# Altium project ActuatorMKII.PrjPcb
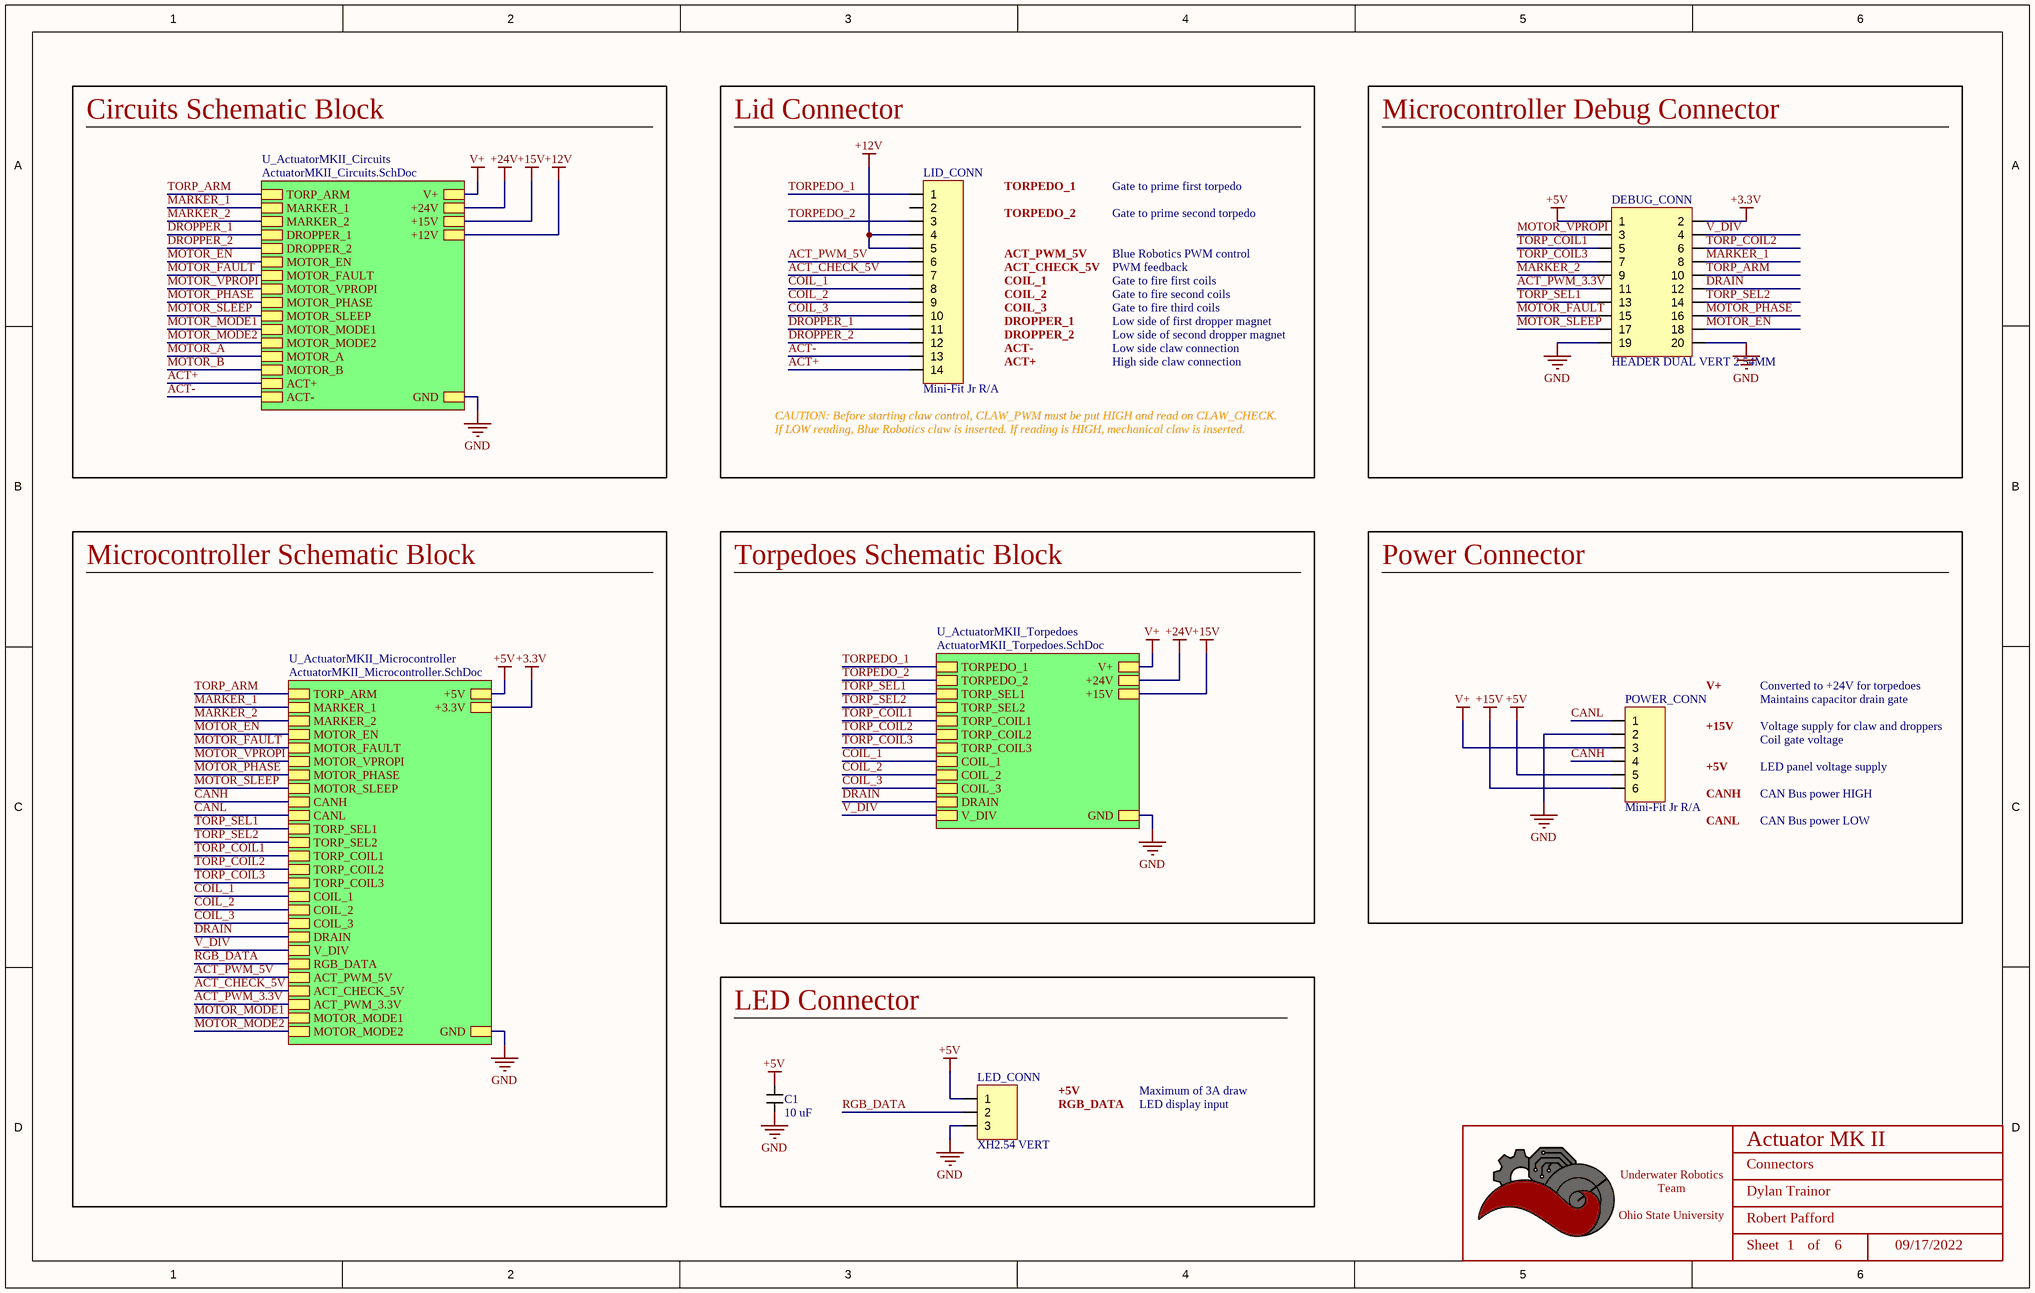
[diagram p0: ActuatorMKII_Connectors.SchDoc]
BoardRevision: 1.1; DateOfDesignReview: 01/07/2023; ProjectTitle: Actuator MK II; TeamLead: Robert Pafford
4 sheets, 100 parts. Net scope: strictly hierarchical (ports join the sheet entries above them; power ports are local).
Board file: ActuatorMKII.PcbDoc
Sheets:
  ActuatorMKII_Connectors.SchDoc
    U_ActuatorMKII_Circuits = ActuatorMKII_Circuits.SchDoc
    U_ActuatorMKII_Torpedoes = ActuatorMKII_Torpedoes.SchDoc
    U_ActuatorMKII_Microcontroller = ActuatorMKII_Microcontroller.SchDoc

## Sheet ActuatorMKII_Connectors.SchDoc: Connectors
size B; Date: 09/17/2022; Author: Dylan Trainor; Organization: ORGANIZATION; Address1: ADDRESS 1; Address2: ADDRESS 2; Address3: ADDRESS 3; Address4: ADDRESS 4; DocumentNumber: 1; Revision: -; SheetNumber: 1; SheetTotal: 6; ENG_APP_DATE: --/--/--; DSN_APP_DATE: --/--/--; CHK_APP_DATE: --/--/--

### Parts
(Parts that share a designator on the sheet are numbered #1, #2 ... from top to bottom, then left to right.)
*#1  Title_Block  [LOGO]  (value not drawn)  (graphical)
C1  Value (uF): 10 uF  [CAPACITOR_0603]  (hidden comment: 10uF Ceramic 6.3V)
DEBUG_CONN  HEADER DUAL VERT 2.54MM  [HEADER_2x10PIN_2.54MM]
LED_CONN  XH2.54 VERT  [CONN_JST_XH254_3POS_VERT]
LID_CONN  Mini-Fit Jr R/A  [CONN_MOLEX_MINIFIT JR_14 POS_R/A]
POWER_CONN  Mini-Fit Jr R/A  [CONN_MOLEX_MINIFIT JR_6 POS_R/A]

### Blocks framed on the sheet
Lid Connector: LID_CONN
Microcontroller Debug Connector: DEBUG_CONN
Power Connector: POWER_CONN
LED Connector: C1 LED_CONN

### Sub-sheets
U_ActuatorMKII_Circuits = ActuatorMKII_Circuits.SchDoc: V+, +15V, +12V, +24V, GND, TORP_ARM, MARKER_1, MARKER_2, DROPPER_1, DROPPER_2, MOTOR_EN, MOTOR_FAULT, MOTOR_VPROPI, MOTOR_PHASE, MOTOR_SLEEP, MOTOR_MODE1, MOTOR_MODE2, MOTOR_A, MOTOR_B, ACT+, ACT-
U_ActuatorMKII_Microcontroller = ActuatorMKII_Microcontroller.SchDoc: GND, +5V, +3.3V, TORP_ARM, MARKER_1, MARKER_2, MOTOR_EN, MOTOR_FAULT, MOTOR_VPROPI, MOTOR_PHASE, MOTOR_SLEEP, CANH, CANL, TORP_SEL1, TORP_SEL2, TORP_COIL1, TORP_COIL2, TORP_COIL3, COIL_1, COIL_2, COIL_3, DRAIN, V_DIV, RGB_DATA, ACT_PWM_5V, ACT_CHECK_5V, ACT_PWM_3.3V, MOTOR_MODE1, MOTOR_MODE2
U_ActuatorMKII_Torpedoes = ActuatorMKII_Torpedoes.SchDoc: V+, +15V, +24V, GND, TORPEDO_1, TORPEDO_2, TORP_SEL1, TORP_SEL2, TORP_COIL1, TORP_COIL2, TORP_COIL3, COIL_1, COIL_2, COIL_3, DRAIN, V_DIV

### Nets
+3.3V: DEBUG_CONN.2 ; sheet U_ActuatorMKII_Microcontroller/+3.3V
+5V: C1.1 DEBUG_CONN.1 LED_CONN.1 POWER_CONN.5 ; sheet U_ActuatorMKII_Microcontroller/+5V
+12V: LID_CONN.4 LID_CONN.5 ; sheet U_ActuatorMKII_Circuits/+12V
+15V: POWER_CONN.6 ; sheet U_ActuatorMKII_Circuits/+15V, sheet U_ActuatorMKII_Torpedoes/+15V
+24V: sheet U_ActuatorMKII_Circuits/+24V, sheet U_ActuatorMKII_Torpedoes/+24V
GND: C1.2 DEBUG_CONN.19 DEBUG_CONN.20 LED_CONN.3 POWER_CONN.2 ; sheet U_ActuatorMKII_Circuits/GND, sheet U_ActuatorMKII_Torpedoes/GND, sheet U_ActuatorMKII_Microcontroller/GND
V+: POWER_CONN.3 ; sheet U_ActuatorMKII_Circuits/V+, sheet U_ActuatorMKII_Torpedoes/V+
ACT+: LID_CONN.14 ; sheet U_ActuatorMKII_Circuits/ACT+
ACT-: LID_CONN.13 ; sheet U_ActuatorMKII_Circuits/ACT-
ACT_CHECK_5V: LID_CONN.7 ; sheet U_ActuatorMKII_Microcontroller/ACT_CHECK_5V
ACT_PWM_3.3V: DEBUG_CONN.11 ; sheet U_ActuatorMKII_Microcontroller/ACT_PWM_3.3V
ACT_PWM_5V: LID_CONN.6 ; sheet U_ActuatorMKII_Microcontroller/ACT_PWM_5V
CANH: POWER_CONN.4 ; sheet U_ActuatorMKII_Microcontroller/CANH
CANL: POWER_CONN.1 ; sheet U_ActuatorMKII_Microcontroller/CANL
COIL_1: LID_CONN.8 ; sheet U_ActuatorMKII_Torpedoes/COIL_1, sheet U_ActuatorMKII_Microcontroller/COIL_1
COIL_2: LID_CONN.9 ; sheet U_ActuatorMKII_Torpedoes/COIL_2, sheet U_ActuatorMKII_Microcontroller/COIL_2
COIL_3: LID_CONN.10 ; sheet U_ActuatorMKII_Torpedoes/COIL_3, sheet U_ActuatorMKII_Microcontroller/COIL_3
DRAIN: DEBUG_CONN.12 ; sheet U_ActuatorMKII_Torpedoes/DRAIN, sheet U_ActuatorMKII_Microcontroller/DRAIN
DROPPER_1: LID_CONN.11 ; sheet U_ActuatorMKII_Circuits/DROPPER_1
DROPPER_2: LID_CONN.12 ; sheet U_ActuatorMKII_Circuits/DROPPER_2
MARKER_1: DEBUG_CONN.8 ; sheet U_ActuatorMKII_Circuits/MARKER_1, sheet U_ActuatorMKII_Microcontroller/MARKER_1
MARKER_2: DEBUG_CONN.9 ; sheet U_ActuatorMKII_Circuits/MARKER_2, sheet U_ActuatorMKII_Microcontroller/MARKER_2
MOTOR_EN: DEBUG_CONN.18 ; sheet U_ActuatorMKII_Circuits/MOTOR_EN, sheet U_ActuatorMKII_Microcontroller/MOTOR_EN
MOTOR_FAULT: DEBUG_CONN.15 ; sheet U_ActuatorMKII_Circuits/MOTOR_FAULT, sheet U_ActuatorMKII_Microcontroller/MOTOR_FAULT
MOTOR_MODE1: sheet U_ActuatorMKII_Circuits/MOTOR_MODE1, sheet U_ActuatorMKII_Microcontroller/MOTOR_MODE1
MOTOR_MODE2: sheet U_ActuatorMKII_Circuits/MOTOR_MODE2, sheet U_ActuatorMKII_Microcontroller/MOTOR_MODE2
MOTOR_PHASE: DEBUG_CONN.16 ; sheet U_ActuatorMKII_Circuits/MOTOR_PHASE, sheet U_ActuatorMKII_Microcontroller/MOTOR_PHASE
MOTOR_SLEEP: DEBUG_CONN.17 ; sheet U_ActuatorMKII_Circuits/MOTOR_SLEEP, sheet U_ActuatorMKII_Microcontroller/MOTOR_SLEEP
MOTOR_VPROPI: DEBUG_CONN.3 ; sheet U_ActuatorMKII_Circuits/MOTOR_VPROPI, sheet U_ActuatorMKII_Microcontroller/MOTOR_VPROPI
RGB_DATA: LED_CONN.2 ; sheet U_ActuatorMKII_Microcontroller/RGB_DATA
TORP_ARM: DEBUG_CONN.10 ; sheet U_ActuatorMKII_Circuits/TORP_ARM, sheet U_ActuatorMKII_Microcontroller/TORP_ARM
TORP_COIL1: DEBUG_CONN.5 ; sheet U_ActuatorMKII_Torpedoes/TORP_COIL1, sheet U_ActuatorMKII_Microcontroller/TORP_COIL1
TORP_COIL2: DEBUG_CONN.6 ; sheet U_ActuatorMKII_Torpedoes/TORP_COIL2, sheet U_ActuatorMKII_Microcontroller/TORP_COIL2
TORP_COIL3: DEBUG_CONN.7 ; sheet U_ActuatorMKII_Torpedoes/TORP_COIL3, sheet U_ActuatorMKII_Microcontroller/TORP_COIL3
TORP_SEL1: DEBUG_CONN.13 ; sheet U_ActuatorMKII_Torpedoes/TORP_SEL1, sheet U_ActuatorMKII_Microcontroller/TORP_SEL1
TORP_SEL2: DEBUG_CONN.14 ; sheet U_ActuatorMKII_Torpedoes/TORP_SEL2, sheet U_ActuatorMKII_Microcontroller/TORP_SEL2
TORPEDO_1: LID_CONN.1 ; sheet U_ActuatorMKII_Torpedoes/TORPEDO_1
TORPEDO_2: LID_CONN.3 ; sheet U_ActuatorMKII_Torpedoes/TORPEDO_2
V_DIV: DEBUG_CONN.4 ; sheet U_ActuatorMKII_Torpedoes/V_DIV, sheet U_ActuatorMKII_Microcontroller/V_DIV

Not connected (* = marked no-connect by the designer): LID_CONN 2

### Notes on the sheet
- Circuits Schematic Block
- TORPEDO_1
- TORPEDO_2
- Gate to prime first torpedo
- Gate to prime second torpedo
- ACT_PWM_5V
- ACT_CHECK_5V
- COIL_1
- COIL_2
- Blue Robotics PWM control
- PWM feedback
- Gate to fire first coils
- Gate to fire second coils
- DROPPER_1
- DROPPER_2
- ACT+
- ACT-
- COIL_3
- Low side of first dropper magnet
- Low side of second dropper magnet
- High side claw connection
- Low side claw connection
- Gate to fire third coils
- (near LID_CONN) CAUTION: Before starting claw control, CLAW_PWM must be put HIGH and read on CLAW_CHECK.
- If LOW reading, Blue Robotics claw is inserted. If reading is HIGH, mechanical claw is inserted.
- Microcontroller Schematic Block
- Torpedoes Schematic Block
- V+
- Converted to +24V for torpedoes
- Maintains capacitor drain gate
- +15V
- +5V
- Voltage supply for claw and droppers
- Coil gate voltage
- LED panel voltage supply
- CANH
- CANL
- CAN Bus power HIGH
- CAN Bus power LOW
- RGB_DATA
- LED display input
- Maximum of 3A draw
- DWG. NO.
- REV.
- SHT.
- THIS DOCUMENT AND THE DATA DISCLOSED HEREIN OR HEREWITH IS THE PROPERTY OF ALTIUM LIMITED AND MAY BE FREELY DISTRIBUTED IN WHOLE. NO RIGHTS ARE RESERVED OR EXPRESS OR IMPLIED WARANTEE GIVEN.
- REVISION
- DESCRIPTION
- DATE
- APPROVED
- ENG:
- APPROVALS
- PROJECT
- DSN:
- CHK:
- REFERENCE DOCUMENTS
- PROJECT REVISION:
- TITLE
- DOCUMENT REVISION:
- DESIGN ITEM:
- BOM:
- FAB DWG:
- PCB DWG:
- ASSY DWG:
- SCALE:
- SIZE
- B
- CAGE CODE
- FILE NAME
- DWG NO.
- SHEET
- OF
- REV
- (in symbol Title_Block) Underwater Robotics Team / Ohio State University; Sheet; of

### Library data of the parts
*#1 = Title_Block: UWRT Schematic Title Block Template / Created June 2021, Dylan Trainor
C1 = CAPACITOR_10uF_0603: Cap 10uF 6.3V +/-20% / Ceramic 0603; Made By: Flip B; ComponentLink1Description: Digikey; ComponentLink1URL: https://www.digikey.com/en/products/detail/samsung-electro-mechanics/CL10A106MQ8NNNC/3886777; Supplier 1: Digi-Key; Supplier Part Number 1: 1276-1119-1-ND; Tolerance: +/- 20%; Voltage: 6.3V
DEBUG_CONN = HEADER_2x10PIN_2.54MM: CONN HEADER VERT 20POS 2.54MM; Made By: Tyson Nguyen; Supplier 1: Digi-Key; Supplier Part Number 1: Z8747-ND
LED_CONN = CONN_JST_XH254_3POS_VERT: JST XH 2.54mm Pitch 3 Pos Vertical; Current Per Pin: 4A; Number of Positions: 3; NOTE: Do not use JST 2.5mm parts with this footprint. JST does not make 2.54mm pitch pins, rather only clones make this connector!; Manufacturer: JST; Pitch: 2.54mm; Configuration: Vertical; Color: White; Created By: Robert P; Series: XH 2.54; ComponentLink1Description: Purchase Link; ComponentLink1URL: https://www.amazon.com/460PCS-XH2-54-Connector-Terminal-Connectors/dp/B09DBGVX5C
LID_CONN = CONN_MOLEX_MINIFIT JR_14POS_R/A: Molex Minifit Jr. 5569 / 14 Pos R/A Natural; Pitch: 4.2mm; Configuration: Right Angle; Current Per Pin: 13A; Number of Positions: 14; Manufacturer: Molex; Color: Natural; Created By: Flip B; ComponentLink1Description: Datasheet; ComponentLink1URL: https://www.molex.com/pdm_docs/ps/PS-5556-001.pdf; Series: Minifit Jr 5569; Supplier 1: Digi-Key; Supplier Part Number 1: WM21356-ND
POWER_CONN = CONN_MOLEX_MINIFIT JR_6POS_R/A: Molex Minifit Jr. 5569 / 6 Pos R/A Natural; Pitch: 4.2mm; Configuration: Right Angle; Current Per Pin: 13A; Number of Positions: 8; Manufacturer: Molex; Color: Natural; Created By: Flip B; ComponentLink1Description: Datasheet; ComponentLink1URL: https://www.molex.com/pdm_docs/ps/PS-5556-001.pdf; Series: Minifit Jr 5569; Supplier 1: Digi-Key; Supplier Part Number 1: WM1353-ND

## Sheet ActuatorMKII_Circuits.SchDoc: Circuits
size B; Date: 09/17/2022; Author: Dylan Trainor; CompanyName: UWRT; Organization: Ohio State University; Address1: ADDRESS 1; Address2: ADDRESS 2; Address3: ADDRESS 3; Address4: ADDRESS 4; DocumentNumber: 2; Revision: -; SheetNumber: 2; SheetTotal: 6; ENG_APP_DATE: --/--/--; DSN_APP_DATE: --/--/--; CHK_APP_DATE: --/--/--
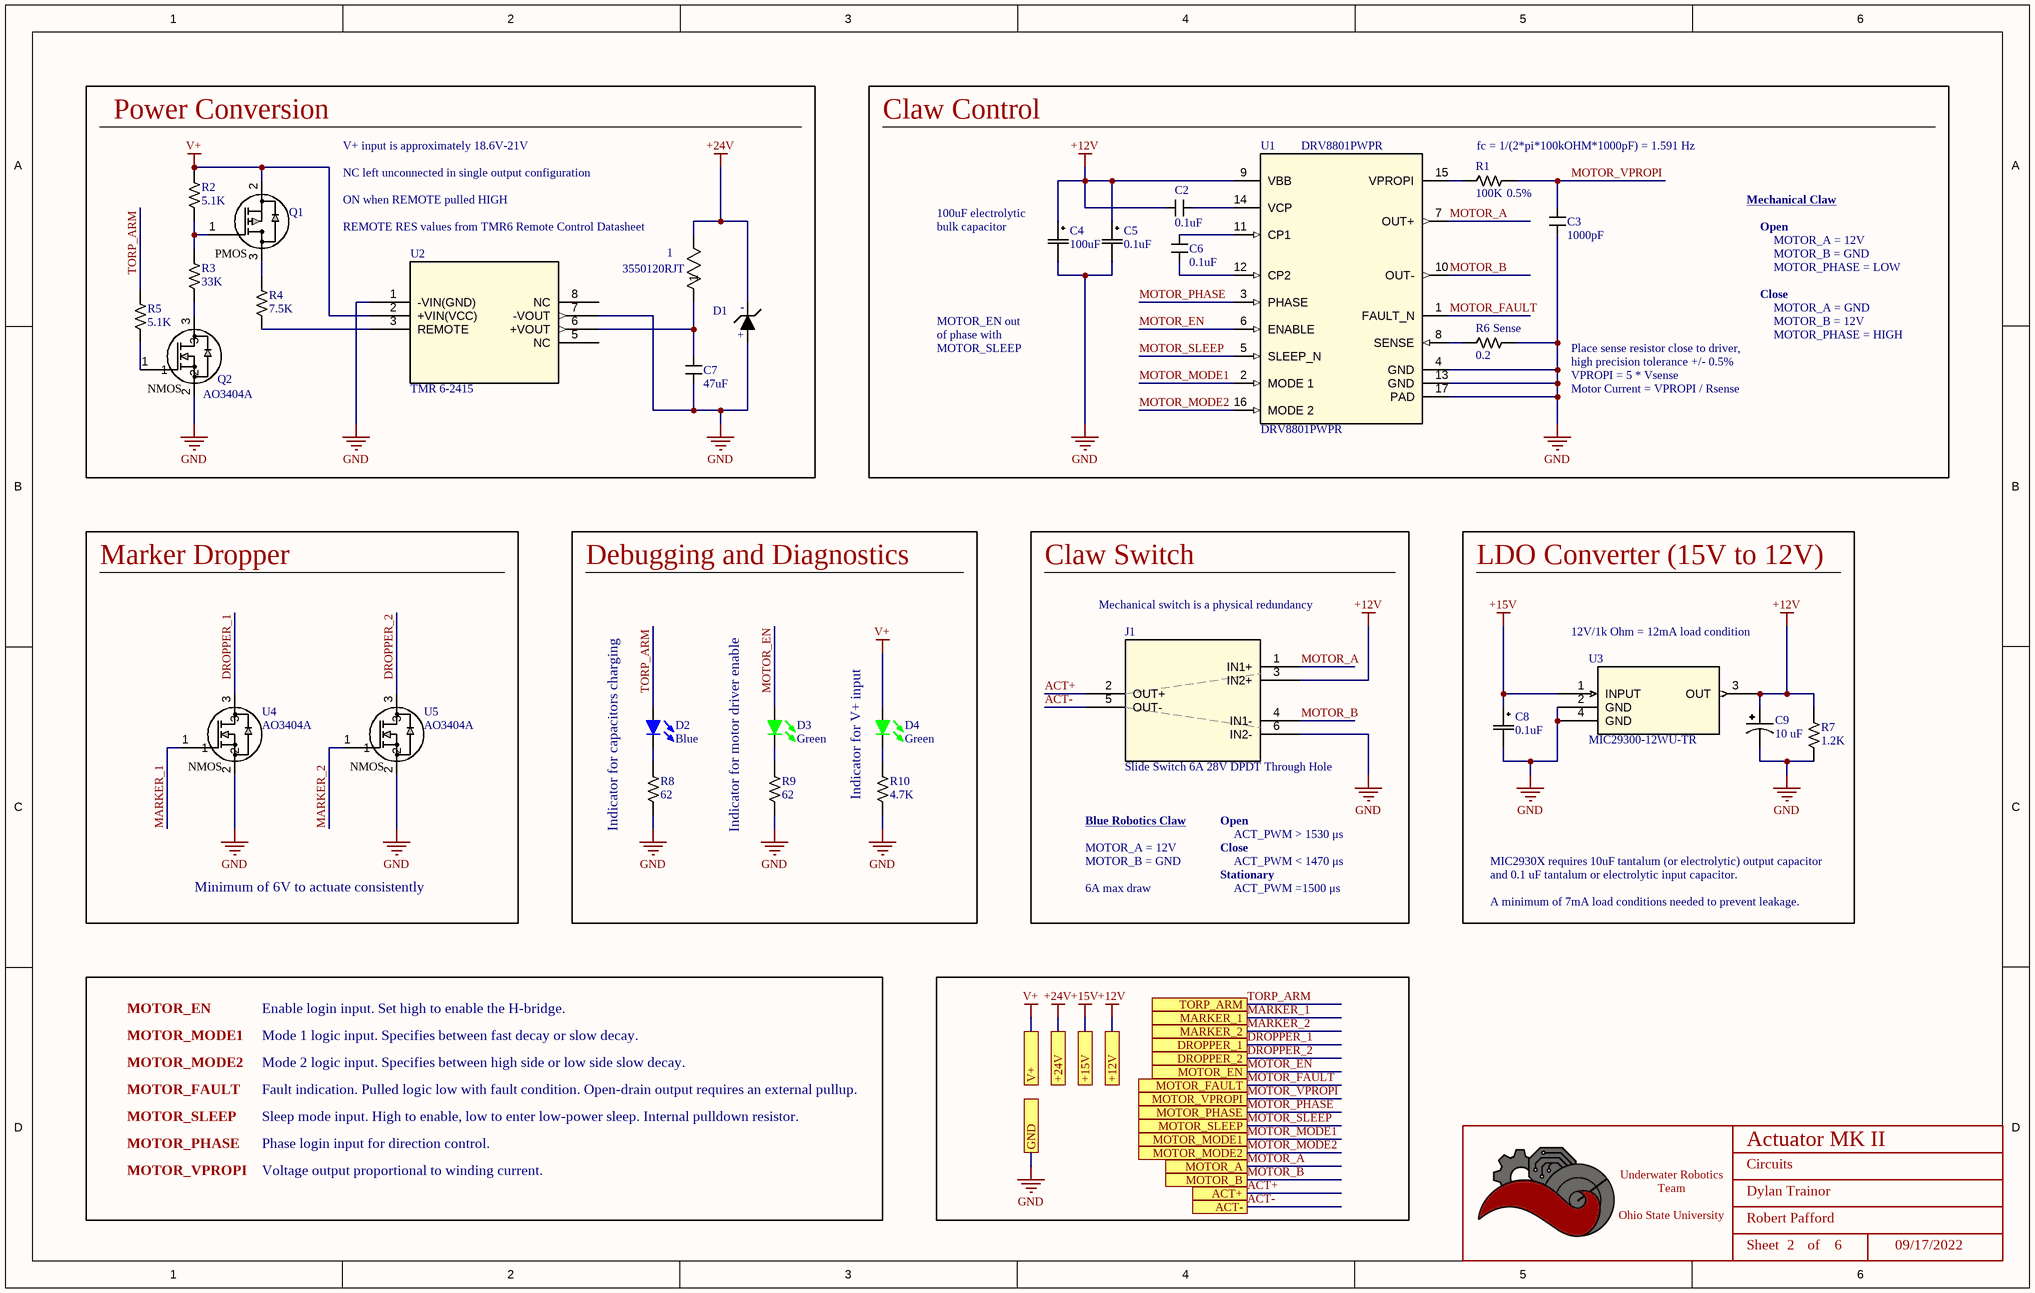
[diagram p1: ActuatorMKII_Circuits.SchDoc]

### Parts
(Parts that share a designator on the sheet are numbered #1, #2 ... from top to bottom, then left to right.)
1  3550120RJT  [RES_3550_TEC]
*#2  Title_Block  [LOGO]  (value not drawn)  (graphical)
C2  value 0.1uF  [CAPACITOR_0805]  (hidden comment: 100nF Ceramic 50V)
C3  value 1000pF  [CAPACITOR_0603]  (hidden comment: 1000pF Ceramic 50V)
C4  value 100uF  [PCAP_8x5.4-ELECT_NCA]  (hidden comment: 100uF electrolytic 35 V)
C5  value 0.1uF  [U2-D_NCH]  (hidden comment: 0.1uF electrolytic 35 V)
C6  value 0.1uF  [CAPACITOR_0805]  (hidden comment: 100nF Ceramic 50V)
C7  value 47uF  [PCAP_8x5.4-ELECT_NCA]  (hidden comment: 47uF Electrolytic 50V)
C8  value 0.1uF  [U2-D_NCH]  (hidden comment: 0.1uF electrolytic 35 V)
C9  Value (uF): 10 uF  [CAPACITOR_1206 - POLAR]  (hidden comment: 10uF Tantalum 16V)
D1  Zener_Diode_10V_410mW  [SOD-123]  (value not drawn)
D2  Color: Blue  [LED_0603]  (hidden comment: 150060BS75000)
D3  Color: Green  [LED_0603]  (hidden comment: IN-S63AT5G)
D4  Color: Green  [LED_0603]  (hidden comment: IN-S63AT5G)
J1  Slide Switch 6A 28V DPDT Through Hole  [CONN_S3CQE2]
Q1  DMP3056L-7  [SOT-23-3]  (value not drawn)
Q2  AO3404A  [SOT-23-3]
R1  Value  (Ohms): 100K  [RESISTOR_0603]  (hidden comment: 100k Ohm 5% 1/8W)
R2  Value  (Ohms): 5.1K  [RESISTOR_0805]  (hidden comment: 5.1k Ohm 1% 1/8W)
R3  Value  (Ohms): 33K  [RESISTOR_0805]  (hidden comment: 33k Ohm 5% 1/8W)
R4  Value  (Ohms): 7.5K  [RESISTOR_0603]  (hidden comment: 7.5k Ohm 5% 1/10W)
R5  Value  (Ohms): 5.1K  [RESISTOR_0805]  (hidden comment: 5.1k Ohm 1% 1/8W)
R6  Value  (Ohms): 0.2  [RESISTOR_2512]  (hidden comment: 0.2 Ohm 1% 2W 2512)
R7  Value  (Ohms): 1.2K  [RESISTOR_0805]  (hidden comment: 1.2k Ohm 5% 1/2W)
R8  Value  (Ohms): 62  [RESISTOR_0603]  (hidden comment: 62 Ohm 1% 1/4W)
R9  Value  (Ohms): 62  [RESISTOR_0603]  (hidden comment: 62 Ohm 1% 1/4W)
R10  Value  (Ohms): 4.7K  [RESISTOR_0603]  (hidden comment: 4.7k Ohm 5% 1/10W)
U1  DRV8801PWPR  [PWP0016B]
U2  TMR 6-2415  [TMR 6_TRP]
U3  MIC29300-12WU-TR  [TO-263-3_MCH]
U4  AO3404A  [SOT-23-3]
U5  AO3404A  [SOT-23-3]

### Blocks framed on the sheet
Power Conversion: 1 C7 D1 Q1 Q2 R2-R5 U2
Claw Control: C2-C6 R1 R6 U1
Marker Dropper: U4 U5
Debugging and Diagnostics: D2-D4 R8-R10
Claw Switch: J1
LDO Converter (15V to 12V): C8 C9 R7 U3

### Ports
+12V, +15V, +24V, ACT+, ACT-, DROPPER_1, DROPPER_2, GND, MARKER_1, MARKER_2, MOTOR_A, MOTOR_B, MOTOR_EN, MOTOR_FAULT, MOTOR_MODE1, MOTOR_MODE2, MOTOR_PHASE, MOTOR_SLEEP, MOTOR_VPROPI, TORP_ARM, V+

### Nets
+12V: C2.2 C4.1 C5.1 C9.1 J1.3(IN2+) R7.1 U1.9(VBB) U3.3(OUT) ; port +12V
+15V: C8.1 U3.1(INPUT) ; port +15V
+24V: 1.2 D1.2 ; port +24V
GND: C3.2 C4.2 C5.2 C7.2 C8.2 C9.2 D1.1 J1.6(IN2-) Q2.2 R6.1 R7.2 R8.2 R9.2 R10.2 U1.4(GND) U1.13(GND) U1.17(PAD) U2.1(-VIN(GND)) U2.7(-VOUT) U3.2(GND) U3.4(GND) U4.2 U5.2 ; port GND
V+: D4.1 Q1.2 R2.1 U2.2(+VIN(VCC)) ; port V+
ACT+: J1.2(OUT+) ; port ACT+
ACT-: J1.5(OUT-) ; port ACT-
DROPPER_1: U4.3 ; port DROPPER_1
DROPPER_2: U5.3 ; port DROPPER_2
MARKER_1: U4.1 ; port MARKER_1
MARKER_2: U5.1 ; port MARKER_2
MOTOR_A: J1.1(IN1+) U1.7(OUT+) ; port MOTOR_A
MOTOR_B: J1.4(IN1-) U1.10(OUT-) ; port MOTOR_B
MOTOR_EN: D3.1 U1.6(ENABLE) ; port MOTOR_EN
MOTOR_FAULT: U1.1(FAULT_N) ; port MOTOR_FAULT
MOTOR_MODE1: U1.2(MODE_1) ; port MOTOR_MODE1
MOTOR_MODE2: U1.16(MODE_2) ; port MOTOR_MODE2
MOTOR_PHASE: U1.3(PHASE) ; port MOTOR_PHASE
MOTOR_SLEEP: U1.5(SLEEP_N) ; port MOTOR_SLEEP
MOTOR_VPROPI: C3.1 R1.1 ; port MOTOR_VPROPI
TORP_ARM: D2.1 R5.1 ; port TORP_ARM
Net1_1: 1.1 C7.1 U2.6(+VOUT)
NetC2_1: C2.1 U1.14(VCP)
NetC6_1: C6.1 U1.11(CP1)
NetC6_2: C6.2 U1.12(CP2)
NetD2_2: D2.2 R8.1
NetD3_2: D3.2 R9.1
NetD4_2: D4.2 R10.1
NetQ1_1: Q1.1 R2.2 R3.1
NetQ1_3: Q1.3 R4.1
NetQ2_1: Q2.1 R5.2
NetQ2_3: Q2.3 R3.2
NetR1_2: R1.2 U1.15(VPROPI)
NetR4_2: R4.2 U2.3(REMOTE)
NetR6_2: R6.2 U1.8(SENSE)

Not connected (* = marked no-connect by the designer): U2 5(NC) 8(NC)

### Notes on the sheet
- V+ input is approximately 18.6V-21V
- (near U1) DRV8801PWPR
- (near R1) fc = 1/(2*pi*100kOHM*1000pF) = 1.591 Hz
- NC left unconnected in single output configuration
- ON when REMOTE pulled HIGH
- (near 1) REMOTE RES values from TMR6 Remote Control Datasheet
- (near C4) 100uF electrolytic
- (near C4) bulk capacitor
- (near R1) 0.5%
- Mechanical Claw
- Open
- Close
- MOTOR_A = 12V
- MOTOR_B = GND
- MOTOR_PHASE = LOW
- MOTOR_EN out
- of phase with
- MOTOR_SLEEP
- (near R6) Sense
- Place sense resistor close to driver,
- high precision tolerance +/- 0.5%
- MOTOR_A = GND
- MOTOR_B = 12V
- MOTOR_PHASE = HIGH
- VPROPI = 5 * Vsense
- Motor Current = VPROPI / Rsense
- Mechanical switch is a physical redundancy
- 12V/1k Ohm = 12mA load condition
- Indicator for capacitors charging
- Indicator for motor driver enable
- Indicator for V+ input
- Blue Robotics Claw
- ACT_PWM > 1530 μs
- Minimum of 6V to actuate consistently
- 6A max draw
- Stationary
- ACT_PWM < 1470 μs
- ACT_PWM =1500 μs
- MIC2930X requires 10uF tantalum (or electrolytic) output capacitor
- and 0.1 uF tantalum or electrolytic input capacitor.
- A minimum of 7mA load conditions needed to prevent leakage.
- MOTOR_EN
- MOTOR_MODE1
- Enable login input. Set high to enable the H-bridge.
- Mode 1 logic input. Specifies between fast decay or slow decay.
- MOTOR_MODE2
- MOTOR_FAULT
- Mode 2 logic input. Specifies between high side or low side slow decay.
- Fault indication. Pulled logic low with fault condition. Open-drain output requires an external pullup.
- MOTOR_PHASE
- MOTOR_VPROPI
- Sleep mode input. High to enable, low to enter low-power sleep. Internal pulldown resistor.
- Phase login input for direction control.
- Voltage output proportional to winding current.
- DWG. NO.
- REV.
- SHT.
- THIS DOCUMENT AND THE DATA DISCLOSED HEREIN OR HEREWITH IS THE PROPERTY OF ALTIUM LIMITED AND MAY BE FREELY DISTRIBUTED IN WHOLE. NO RIGHTS ARE RESERVED OR EXPRESS OR IMPLIED WARANTEE GIVEN.
- REVISION
- DESCRIPTION
- DATE
- APPROVED
- ENG:
- APPROVALS
- PROJECT
- DSN:
- CHK:
- REFERENCE DOCUMENTS
- PROJECT REVISION:
- TITLE
- DOCUMENT REVISION:
- DESIGN ITEM:
- BOM:
- FAB DWG:
- PCB DWG:
- ASSY DWG:
- SCALE:
- SIZE
- B
- CAGE CODE
- FILE NAME
- DWG NO.
- SHEET
- OF
- REV
- (in symbol AO3404A) NMOS
- (in symbol DMP3056L-7) PMOS
- (in symbol Title_Block) Underwater Robotics Team / Ohio State University; Sheet; of
- (in symbol Zener_Diode_10V_410mW) -; +

### Library data of the parts
1 = 3550120RJT: RES 3550 120R 5%; Mfr_Name: TE Connectivity; Copyright: Copyright (C) 2022 Ultra Librarian. All rights reserved.; Manufacturer_Part_Number: 3550120RJT; RefDes: RefDes; Type: DEV; Supplier 1: RSComponents; Supplier Part Number 1: 1866355P
*#2 = Title_Block: as *#1 on sheet ActuatorMKII_Connectors
C2 C6 = CAPACITOR_0.1uF_0402_1: Cap 100nF 50V +/-10% / Ceramic 0805; Voltage: 25V; Made By: Robert Pafford; Tolerance: +/- 10%; Supplier 1: Newark; Supplier Part Number 1: 38AH3645
C3 = CAPACITOR_0.001uF_0603: Cap 1000pF 50V +/-2% / Ceramic 0603; Voltage: 50; Made By: Flip B; ComponentLink1Description: Datsheet; ComponentLink1URL: https://datasheets.avx.com/C0GNP0-Dielectric.pdf; Tolerance: +/- 2%; Supplier 1: Arrow Electronics; Supplier Part Number 1: C0603C102K5RACTU
C4 = CAP ALUM 100UF 20% 35V SMD: 100 µF 35 V Aluminum Electrolytic Capacitors Radial, Can - SMD 1000 Hrs; Mfr_Name: Nichicon; Manufacturer_Part_Number: UCB1V0R1MCL1GS; Type: DEV; Made by: Tyson Nguyen; Copyright: Copyright (C) 2022 Ultra Librarian. All rights reserved.; RefDes: RefDes; Supplier 1: Newark; Supplier Part Number 1: 85Y4753
C5 C8 = CAP ALUM 0.1UF 20% 35V SMD: 0.1 µF 35 V Aluminum Electrolytic Capacitors Radial, Can - SMD 7000 Hrs @ 105°C; Mfr_Name: Nichicon; Manufacturer_Part_Number: UCB1V0R1MCL1GS; Type: DEV; Made by: Tyson Nguyen; Copyright: Copyright (C) 2022 Ultra Librarian. All rights reserved.; RefDes: RefDes; Supplier 1: Digi-Key; Supplier Part Number 1: 493-9956-1-ND
C7 = CAP_ALUM_47uF: CAP ALUM 47uF 50V +/-20% / 8x5.4; Voltage: 6.3V; Made By: Flip B; ComponentLink1Description: Datsheet; ComponentLink1URL: https://www.mouser.com/datasheet/2/212/KEM_C1002_X7R_SMD-1102033.pdf; Tolerance: +/- 20%; Supplier 1: Digi-Key; Supplier Part Number 1: PCE3815CT-ND
C9 = CAPACITOR_10uF_1206_Tantalum_1: Cap 10uF 16V +/-20% / Tantalum 1206; Tolerance: +/- 10%; Made By: Dylan T; ComponentLink1Description: Digikey; ComponentLink1URL: https://www.digikey.com/en/products/detail/kyocera-avx/F981A106MMA/4004990; Voltage: 16V; Supplier 1: Newark; Supplier Part Number 1: 26AC4143
D1 = Zener_Diode_10V_410mW: Zener Diode | 10 V | 410 mW | SOD 123; Made By: Nathan A; Voltage - Zener: 10V; Power: 410mW; Package: SOD-123; Supplier 1: Digi-Key; Supplier Part Number 1: 3757-BZT52-C10_R1_00001CT-ND; ComponentLink1Description: Datasheet; ComponentLink1URL: https://www.panjit.com.tw/upload/datasheet/BZT52-C2V4_SERIES.pdf
D2 = LED_Blue_0603: LED Blue Vf= 3.2V If = 0.020A / 150060BS75000; Made By: Robert Pafford; Forward Current: 20mA; Forward Voltage: 3.2V; Package: 0603; Supplier 1: Digi-Key; Supplier Part Number 1: 732-4966-1-ND
D3 D4 = LED_Green_0603_3V: LED Green Vf= 3V If = 0.005A / IN-S63AT5G; Made By: Robert Pafford; Forward Current: 5mA; ComponentLink1Description: Datasheet; ComponentLink1URL: https://www.we-online.de/katalog/datasheet/150060GS75000.pdf; Forward Voltage: 3V; Package: 0603; Supplier 1: Digi-Key; Supplier Part Number 1: 1830-1062-1-ND
J1 = Slide DPDT Switch: SWITCH SLIDE DPDT 6A 28V Through Hole; Mfr_Name: C&K; Manufacturer_Part_Number: 1201M2S3CQE2; Copyright: Copyright (C) 2022 Ultra Librarian. All rights reserved.; RefDes: RefDes; Type: DEV; Supplier 1: Newark; Supplier Part Number 1: 36AH1005
Q1 = DMP3056L-7: P-Channel 30V 4.3A (Ta) 1.38W (Ta) Surface Mount SOT23; Reviewed By: ---; VDSS (Max): -30V; Vgss (Max): +-25V; Id: -4.3A; Created By: John Ulm; Supplier 1: Digi-Key; Supplier Part Number 1: DMP3056L-7DICT-ND
Q2 U4 U5 = AO3404A: N-Channel 30 V 5.8A (Ta) 1.4W (Ta) Surface Mount SOT-23-3; Vendor: Alpha & Omega Semiconductor Inc.; SourceLibrary: ON_Semiconductor_2020-01-13; Vgs (Max): 3V @ 5.8A, 10V; Vgs (th): 3V @ 250µA; Vdss: 30V; Rds (on): 28mOhm @ 5.8A, 10V; Amp Rating: 5.8 A; FET Type: N-Channel; Package: SOT23-3L; Manufacturer _Part_Number: AO3404A; Power Dissipation: 1.4W (Ta); Supplier 1: Digi-Key; Supplier Part Number 1: 785-1004-1-ND; Created By: Dylan T
R1 = RESISTOR_100K_0603_1: RES 100k OHM 5% 1/10W 0603; Tolerance: +/- 5%; Made By: Flip B; ComponentLink1Description: Datasheet; ComponentLink1URL: https://www.bourns.com/docs/product-datasheets/CRxxxxx.pdf; Wattage: 1/10W; Supplier: Digikey; Digikey Part Numer: CR0603-JW-104ELFTR-ND; Supplier 1: Digi-Key; Supplier Part Number 1: CR0603-JW-104ELFCT-ND
R2 R5 = RESISTOR_5.1K_0805: RES 5.1k OHM 1% 1/8W 0805; Tolerance: +/- 5%; Made By: Dylan Trainor; ComponentLink1Description: Datasheet; ComponentLink1URL: https://www.bourns.com/docs/product-datasheets/CRxxxxx.pdf; Wattage: 1/8W; Supplier: Digikey; Digikey Part Numer: CR0603-JW-104ELFTR-ND; Supplier 1: Newark; Supplier Part Number 1: 53W4863
R3 = RESISTOR_33K_0805: RES 33k OHM 5% 1/8W 0805; Tolerance: +/- 5%; Made By: Dylan Trainor; ComponentLink1Description: Datasheet; ComponentLink1URL: https://www.bourns.com/docs/product-datasheets/CRxxxxx.pdf; Wattage: 1/8W; Supplier: Digikey; Digikey Part Numer: CR0603-JW-104ELFTR-ND; Supplier 1: Newark; Supplier Part Number 1: 65T8819
R4 = RESISTOR_7.5K_0603: RES 7.5k OHM 5% 1/10W 0603; Tolerance: +/- 5%; Wattage: 1/8W; Made By: Dylan Trainor; ComponentLink1Description: Datasheet; ComponentLink1URL: https://www.bourns.com/docs/product-datasheets/CRxxxxx.pdf; Supplier: Digikey; Digikey Part Numer: CR0603-JW-104ELFTR-ND; Supplier 1: Arrow Electronics; Supplier Part Number 1: CRCW06037K50JNEA
R6 = RESISTOR_0.2_1%_2512: RES 0.2 OHM 1% 2W 2512; Tolerance: +/- 1%; Made By: Dylan Trainor; ComponentLink1Description: Datasheet; ComponentLink1URL: https://www.bourns.com/docs/product-datasheets/CRxxxxx.pdf; Wattage: 2W; Supplier: Stackpole; Digikey Part Numer: CR0603-JW-104ELFTR-ND; Supplier 1: Avnet; Supplier Part Number 1: CSRN2512FKR200
R7 = RESISTOR_1.2K_0805: RES 1.2k OHM 5% 1/2W 0805; Tolerance: +/- 5%; Made By: Robert Pafford; Wattage: 1/2W; Supplier 1: Digi-Key; Supplier Part Number 1: P1.2KADCT-ND
R8 R9 = RESISTOR_62_0603: RES SMD 62 OHM 1% 1/4W 0603; Tolerance: +/- 1%; Made By: Robert Pafford; ComponentLink1Description: Datasheet; ComponentLink1URL: https://www.bourns.com/docs/product-datasheets/CRxxxxx.pdf; Wattage: 1/4W; Supplier: Digikey; Digikey Part Numer: CR0603-JW-104ELFTR-ND; Supplier 1: Digi-Key; Supplier Part Number 1: 541-RCS060362R0FKEACT-ND
R10 = RESISTOR_4.7K_0603: RES 4.7k OHM 5% 1/10W 0603; Tolerance: +/- 5%; Made By: Robert Pafford; Wattage: 1/10W; Supplier: Digikey; Digikey Part Numer: CR0603-JW-104ELFTR-ND; Supplier 1: Digi-Key; Supplier Part Number 1: RMCF0603JT4K70CT-ND
U1 = DRV8801PWPR: Bipolar Motor Driver DMOS Parallel 16-HTSSOP; Mfr_Name: Texas Instruments; CompType: IC; Type: DEV; RefDes: RefDes; Copyright: Copyright (C) 2022 Ultra Librarian. All rights reserved.; Manufacturer_Part_Number: DRV8801PWPR; PartNumber: DRV8801PWP; PackageReference: PWP0016B; MountType: SMT; RoHS: Y; Manufacturer: Texas Instruments; Supplier 1: Digi-Key; Supplier Part Number 1: 296-25378-1-ND
U2 = TMR 6-2415: No Description Available; Mfr_Name: Traco Power; Copyright: Copyright (C) 2022 Ultra Librarian. All rights reserved.; Manufacturer_Part_Number: TMR 6-2415; RefDes: RefDes; Type: DEV; Supplier 1: Digi-Key; Supplier Part Number 1: 1951-1797-ND
U3 = MIC29300-12WU-TR: Linear Voltage Regulator IC Positive Fixed 1 Output 3A TO-263-3; Mfr_Name: Microchip; Copyright: Copyright (C) 2022 Ultra Librarian. All rights reserved.; Manufacturer_Part_Number: MIC29300-12WU-TR; RefDes: RefDes; Type: DEV; Supplier 1: Arrow Electronics; Supplier Part Number 1: MIC29300-12WU-TR

## Sheet ActuatorMKII_Torpedoes.SchDoc: ActuatorMKII_Torpedoes
size B; Date: 09/17/2022; Author: Dylan Trainor; CompanyName: UWRT; Organization: Ohio State University; Address1: ADDRESS 1; Address2: ADDRESS 2; Address3: ADDRESS 3; Address4: ADDRESS 4; Revision: -; SheetNumber: 3; SheetTotal: 6; ENG_APP_DATE: --/--/--; DSN_APP_DATE: --/--/--; CHK_APP_DATE: --/--/--
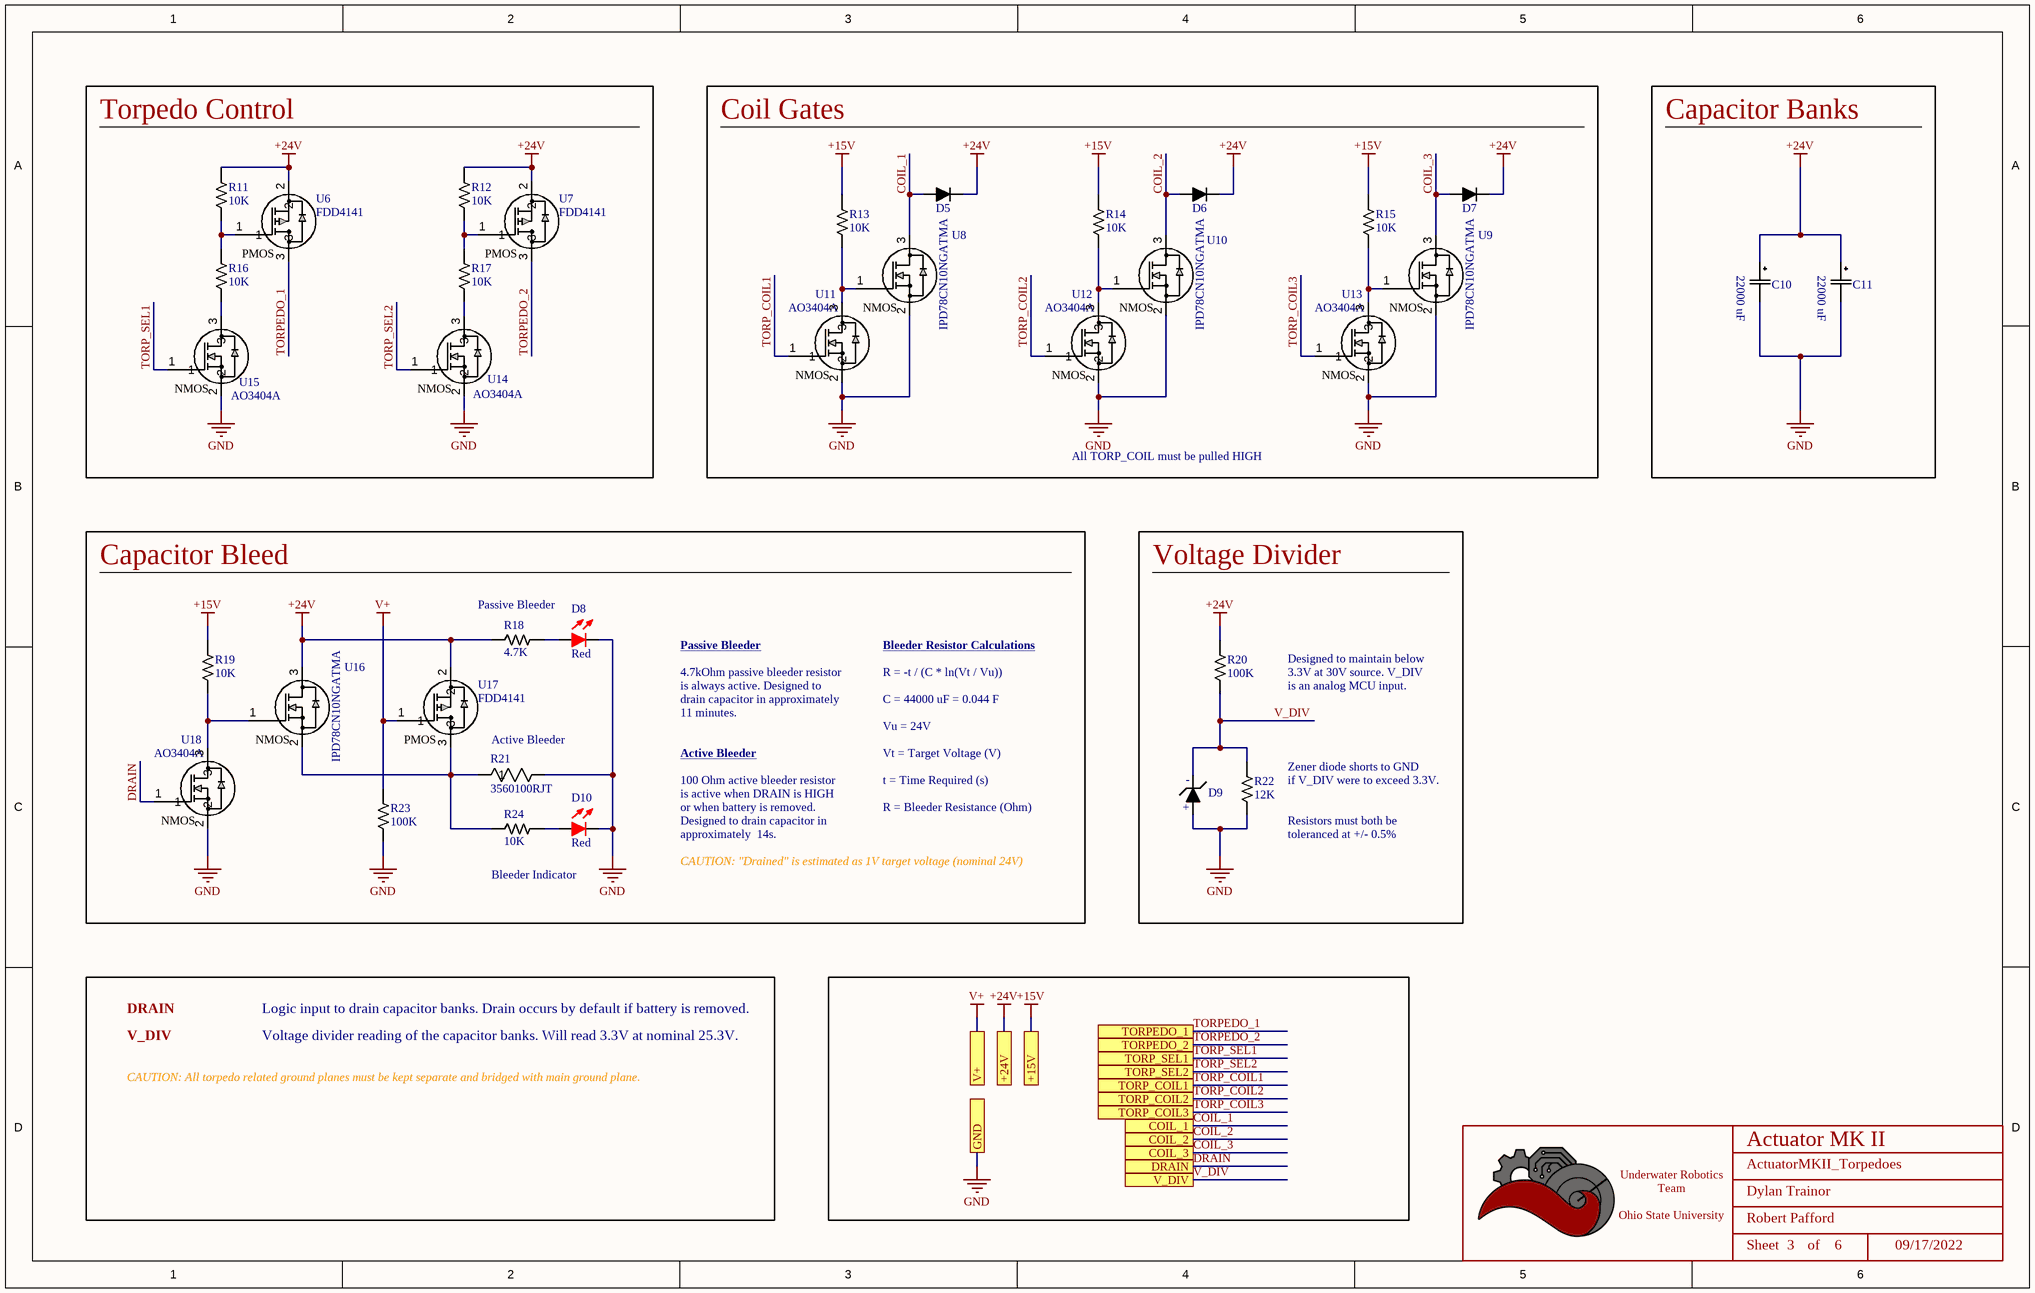
[diagram p2: ActuatorMKII_Torpedoes.SchDoc]

### Parts
(Parts that share a designator on the sheet are numbered #1, #2 ... from top to bottom, then left to right.)
*#3  Title_Block  [LOGO]  (value not drawn)  (graphical)
C10  Cap 22000uF 22V +/-20% Aluminum  [UVK1E223MRD_RA]  (value not drawn)
C11  Cap 22000uF 22V +/-20% Aluminum  [UVK1E223MRD_RA]  (value not drawn)
D5  B330-13-F  [DO-214AB]  (value not drawn)
D6  B330-13-F  [DO-214AB]  (value not drawn)
D7  B330-13-F  [DO-214AB]  (value not drawn)
D8  Color: Red  [LED_0603]  (hidden comment: 150060RS75000)
D9  Zener_Diode_3.3V_250mW_1  [SOD-123]  (value not drawn)
D10  Color: Red  [LED_0603]  (hidden comment: 150060RS75000)
R11  Value  (Ohms): 10K  [RESISTOR_0603]  (hidden comment: 10k Ohm 5% 1/10W)
R12  Value  (Ohms): 10K  [RESISTOR_0603]  (hidden comment: 10k Ohm 5% 1/10W)
R13  Value  (Ohms): 10K  [RESISTOR_0603]  (hidden comment: 10k Ohm 5% 1/10W)
R14  Value  (Ohms): 10K  [RESISTOR_0603]  (hidden comment: 10k Ohm 5% 1/10W)
R15  Value  (Ohms): 10K  [RESISTOR_0603]  (hidden comment: 10k Ohm 5% 1/10W)
R16  Value  (Ohms): 10K  [RESISTOR_0603]  (hidden comment: 10k Ohm 5% 1/10W)
R17  Value  (Ohms): 10K  [RESISTOR_0603]  (hidden comment: 10k Ohm 5% 1/10W)
R18  Value  (Ohms): 4.7K  [RESISTOR_0603]  (hidden comment: 4.7k Ohm 5% 1/10W)
R19  Value  (Ohms): 10K  [RESISTOR_0603]  (hidden comment: 10k Ohm 5% 1/10W)
R20  Value  (Ohms): 100K  [RESISTOR_0603]  (hidden comment: 100k Ohm 0.5% 1/10W)
R21  3560100RJT  [RES_3550_TEC]
R22  Value  (Ohms): 12K  [RESISTOR_0603]  (hidden comment: 12k Ohm 0.5% 1/10W)
R23  Value  (Ohms): 100K  [RESISTOR_0603]  (hidden comment: 100k Ohm 5% 1/8W)
R24  Value  (Ohms): 10K  [RESISTOR_0603]  (hidden comment: 10k Ohm 5% 1/10W)
U6  FDD4141  [DPAK_ONS]
U7  FDD4141  [DPAK_ONS]
U8  MOSFET N-Ch 100V 13A TO252-3  [DPAK_ONS]  (value not drawn)
U9  MOSFET N-Ch 100V 13A TO252-3  [DPAK_ONS]  (value not drawn)
U10  MOSFET N-Ch 100V 13A TO252-3  [DPAK_ONS]  (value not drawn)
U11  AO3404A  [SOT-23-3]
U12  AO3404A  [SOT-23-3]
U13  AO3404A  [SOT-23-3]
U14  AO3404A  [SOT-23-3]
U15  AO3404A  [SOT-23-3]
U16  MOSFET N-Ch 100V 13A TO252-3  [DPAK_ONS]  (value not drawn)
U17  FDD4141  [DPAK_ONS]
U18  AO3404A  [SOT-23-3]

### Blocks framed on the sheet
Torpedo Control: R11 R12 R16 R17 U6 U7 U14 U15
Coil Gates: D5-D7 R13-R15 U8-U13
Capacitor Bleed: D8 D10 R18 R19 R21 R23 R24 U16-U18
Voltage Divider: D9 R20 R22

### Ports
+15V, +24V, COIL_1, COIL_2, COIL_3, DRAIN, GND, TORP_COIL1, TORP_COIL2, TORP_COIL3, TORP_SEL1, TORP_SEL2, TORPEDO_1, TORPEDO_2, V+, V_DIV

### Nets
+15V: R13.1 R14.1 R15.1 R19.1 ; port +15V
+24V: C10.1 C11.1 D5.2 D6.2 D7.2 R11.1 R12.1 R18.2 R20.1 U6.2 U7.2 U16.3 U17.2 ; port +24V
GND: C10.2 C11.2 D8.2 D9.1 D10.2 R21.2 R22.2 R23.2 U8.2 U9.2 U10.2 U11.2 U12.2 U13.2 U14.2 U15.2 U18.2 ; port GND
V+: R23.1 U17.1 ; port V+
COIL_1: D5.1 U8.3 ; port COIL_1
COIL_2: D6.1 U10.3 ; port COIL_2
COIL_3: D7.1 U9.3 ; port COIL_3
DRAIN: U18.1 ; port DRAIN
TORP_COIL1: U11.1 ; port TORP_COIL1
TORP_COIL2: U12.1 ; port TORP_COIL2
TORP_COIL3: U13.1 ; port TORP_COIL3
TORP_SEL1: U15.1 ; port TORP_SEL1
TORP_SEL2: U14.1 ; port TORP_SEL2
TORPEDO_1: U6.3 ; port TORPEDO_1
TORPEDO_2: U7.3 ; port TORPEDO_2
V_DIV: D9.2 R20.2 R22.1 ; port V_DIV
NetD8_1: D8.1 R18.1
NetD10_1: D10.1 R24.1
NetR11_2: R11.2 R16.1 U6.1
NetR12_2: R12.2 R17.1 U7.1
NetR13_2: R13.2 U8.1 U11.3
NetR14_2: R14.2 U10.1 U12.3
NetR15_2: R15.2 U9.1 U13.3
NetR16_2: R16.2 U15.3
NetR17_2: R17.2 U14.3
NetR19_2: R19.2 U16.1 U18.3
NetR21_1: R21.1 R24.2 U16.2 U17.3

### Notes on the sheet
- Capacitor Banks
- All TORP_COIL must be pulled HIGH
- Passive Bleeder
- 4.7kOhm passive bleeder resistor
- is always active. Designed to
- drain capacitor in approximately
- R = -t / (C * ln(Vt / Vu))
- C = 44000 uF = 0.044 F
- Bleeder Resistor Calculations
- Designed to maintain below
- 3.3V at 30V source. V_DIV
- is an analog MCU input.
- Active Bleeder
- 11 minutes.
- Vu = 24V
- Vt = Target Voltage (V)
- (near R22) Zener diode shorts to GND
- 100 Ohm active bleeder resistor
- is active when DRAIN is HIGH
- Designed to drain capacitor in
- approximately  14s.
- or when battery is removed.
- t = Time Required (s)
- R = Bleeder Resistance (Ohm)
- (near R22) if V_DIV were to exceed 3.3V.
- (near R22) Resistors must both be
- (near R22) toleranced at +/- 0.5%
- Bleeder Indicator
- CAUTION: "Drained" is estimated as 1V target voltage (nominal 24V)
- DRAIN
- V_DIV
- Logic input to drain capacitor banks. Drain occurs by default if battery is removed.
- Voltage divider reading of the capacitor banks. Will read 3.3V at nominal 25.3V.
- CAUTION: All torpedo related ground planes must be kept separate and bridged with main ground plane.
- DWG. NO.
- REV.
- SHT.
- THIS DOCUMENT AND THE DATA DISCLOSED HEREIN OR HEREWITH IS THE PROPERTY OF ALTIUM LIMITED AND MAY BE FREELY DISTRIBUTED IN WHOLE. NO RIGHTS ARE RESERVED OR EXPRESS OR IMPLIED WARANTEE GIVEN.
- REVISION
- DESCRIPTION
- DATE
- APPROVED
- ENG:
- APPROVALS
- PROJECT
- DSN:
- CHK:
- REFERENCE DOCUMENTS
- PROJECT REVISION:
- TITLE
- DOCUMENT REVISION:
- DESIGN ITEM:
- BOM:
- FAB DWG:
- PCB DWG:
- ASSY DWG:
- SCALE:
- SIZE
- B
- CAGE CODE
- FILE NAME
- DWG NO.
- SHEET
- OF
- REV
- (in symbol AO3404A) NMOS
- (in symbol CAPACITOR_22000uF_Radial) 22000 uF
- (in symbol FDD4141) PMOS
- (in symbol IPD78CN10NGATMA1) NMOS; IPD78CN10NGATMA
- (in symbol Title_Block) Underwater Robotics Team / Ohio State University; Sheet; of
- (in symbol Zener_Diode_3.3V_250mW_1) -; +

### Library data of the parts
*#3 = Title_Block: as *#1 on sheet ActuatorMKII_Connectors
C10 C11 = CAPACITOR_22000uF_Radial: Cap 22000uF 25V 20% Aluminum Radial Through Hole; Voltage Range: 6.3-450V; Made By: Cole Davis; Verified By: Name; Value: 22000uF; Supplier 1: Digi-Key; Supplier Part Number 1: 493-12405-ND
D5-D7 = SCHOTTKY_30V_3A: Schottky Diode, 30V reverse breakdown, 3A, Vf = 0.500V; Made By: Tyson N.; Forward Voltage: 500mV; ComponentLink1Description: Datasheet; ComponentLink1URL: https://www.onsemi.com/pdf/datasheet/mbr0520lt1-d.pdf; Forward Current: 3A; Package: DO-214AB; Supplier 1: RSComponents; Supplier Part Number 1: 7513269
D8 D10 = LED_Red_0603: LED Red Vf= 2V If = 0.020A / 150060RS75000; Made By: Robert Pafford; Forward Current: 20mA; Forward Voltage: 2V; Package: 0603; Supplier 1: Digi-Key; Supplier Part Number 1: 732-4978-1-ND
D9 = Zener_Diode_3.3V_250mW_1: Zener Diode | 3.3 V | 250 mW | SOT-23; Made By: Nathan A; Voltage - Zener: 10V; Power: 410mW; Package: SOD-123; ComponentLink1Description: Datasheet; ComponentLink1URL: https://www.panjit.com.tw/upload/datasheet/BZT52-C2V4_SERIES.pdf; Supplier 1: Newark; Supplier Part Number 1: 50AC7315
R11-R17 R19 R24 = RESISTOR_10K_0603: RES 10k OHM 5% 1/10W 0603; Tolerance: +/- 5%; Wattage: 1/8W; Made By: Robert Pafford; ComponentLink1Description: Datasheet; ComponentLink1URL: https://www.bourns.com/docs/product-datasheets/CRxxxxx.pdf; Supplier: Digikey; Digikey Part Numer: CR0603-JW-104ELFTR-ND; Supplier 1: Digi-Key; Supplier Part Number 1: 2019-RK73B1JTTD103JCT-ND
R18 = RESISTOR_4.7K_0603: as R10 on sheet ActuatorMKII_Circuits; Wattage: 1/10W; Supplier: Digikey; Digikey Part Numer: CR0603-JW-104ELFTR-ND; Supplier 1: Digi-Key; Supplier Part Number 1: RMCF0603JT4K70CT-ND
R20 = RESISTOR_100K_0.5%_0603: RES 100k OHM 0.5% 1/10W 0603; Tolerance: +/- 0.5%; Made By: John Ulm; ComponentLink1Description: Datasheet; ComponentLink1URL: https://www.bourns.com/docs/product-datasheets/CRxxxxx.pdf; Wattage: 1/10W; Supplier: Digikey; Digikey Part Numer: CR0603-JW-104ELFTR-ND; Supplier 1: Digi-Key; Supplier Part Number 1: 311-2395-1-ND
R21 = 3560100RJT: RES 35601 100R 6W 5%; Mfr_Name: TE Connectivity; Manufacturer_Part_Number: 3550120RJT; Copyright: Copyright (C) 2022 Ultra Librarian. All rights reserved.; RefDes: RefDes; Type: DEV; Supplier 1: Newark; Supplier Part Number 1: 34AH4272
R22 = RESISTOR_12K_0.5%_0603: RES 12k OHM 0.5% 1/10W 0603; Tolerance: +/- 0.5%; Wattage: 1/8W; Made By: John Ulm; ComponentLink1Description: Datasheet; ComponentLink1URL: https://www.bourns.com/docs/product-datasheets/CRxxxxx.pdf; Supplier: Digikey; Digikey Part Numer: CR0603-JW-104ELFTR-ND; Supplier 1: Digi-Key; Supplier Part Number 1: 311-2415-1-ND
R23 = RESISTOR_100K_0603_1: as R1 on sheet ActuatorMKII_Circuits; ComponentLink1Description: Datasheet; ComponentLink1URL: https://www.bourns.com/docs/product-datasheets/CRxxxxx.pdf; Wattage: 1/10W; Supplier: Digikey; Digikey Part Numer: CR0603-JW-104ELFTR-ND; Supplier 1: Digi-Key; Supplier Part Number 1: CR0603-JW-104ELFCT-ND
U6 U7 U17 = FDD4141: P-Channel 10.8A (Ta), 50A (Tc) 2.4W (Ta), 69W (Tc) Surface Mount D-PAK (TO-252AA); FET Type: P-Channel, Power; Vendor: ON Semiconductor; SourceLibrary: ON_Semiconductor_2020-01-13; Vgs (Max): ±20V; Vgs (th): 3V @ 250µA; Vdss: 40 V; Rds (on): 12.3mOhm @ 12.7A, 10V; Amp Rating: 10.8 A; Package: D-PAK (TO-252AA); Manufacturer_Part_Number: FDD4141; Power Dissipation: 2.4W (Ta), 69W (Tc); Supplier 1: Digi-Key; Supplier Part Number 1: FDD4141CT-ND; Created By: Dylan T
U8-U10 U16 = IPD78CN10NGATMA1: N-Channel 100 V 13A (Tc) 31W (Tc) Surface Mount PG-TO252-3; Vg(th): 2V<4V; Created By: John Ulm; Verified By: ----; Supplier 1: Digi-Key; VDS: 100V; Continuous drain current: 13A; Supplier Part Number 1: IPD78CN10NGATMA1CT-ND
U11-U15 U18 = AO3404A: as Q2 on sheet ActuatorMKII_Circuits; Amp Rating: 5.8 A; FET Type: N-Channel; Package: SOT23-3L; Manufacturer _Part_Number: AO3404A; Power Dissipation: 1.4W (Ta); Supplier 1: Digi-Key; Supplier Part Number 1: 785-1004-1-ND; Created By: Dylan T

## Sheet ActuatorMKII_Microcontroller.SchDoc: ActuatorMKII_Microcontroller
size B; Date: MM/DD/YYYY; Author: Dylan Trainor; Organization: ORGANIZATION; Address1: ADDRESS 1; Address2: ADDRESS 2; Address3: ADDRESS 3; Address4: ADDRESS 4; Revision: -; SheetNumber: 4; SheetTotal: 6; ENG_APP_DATE: --/--/--; DSN_APP_DATE: --/--/--; CHK_APP_DATE: --/--/--
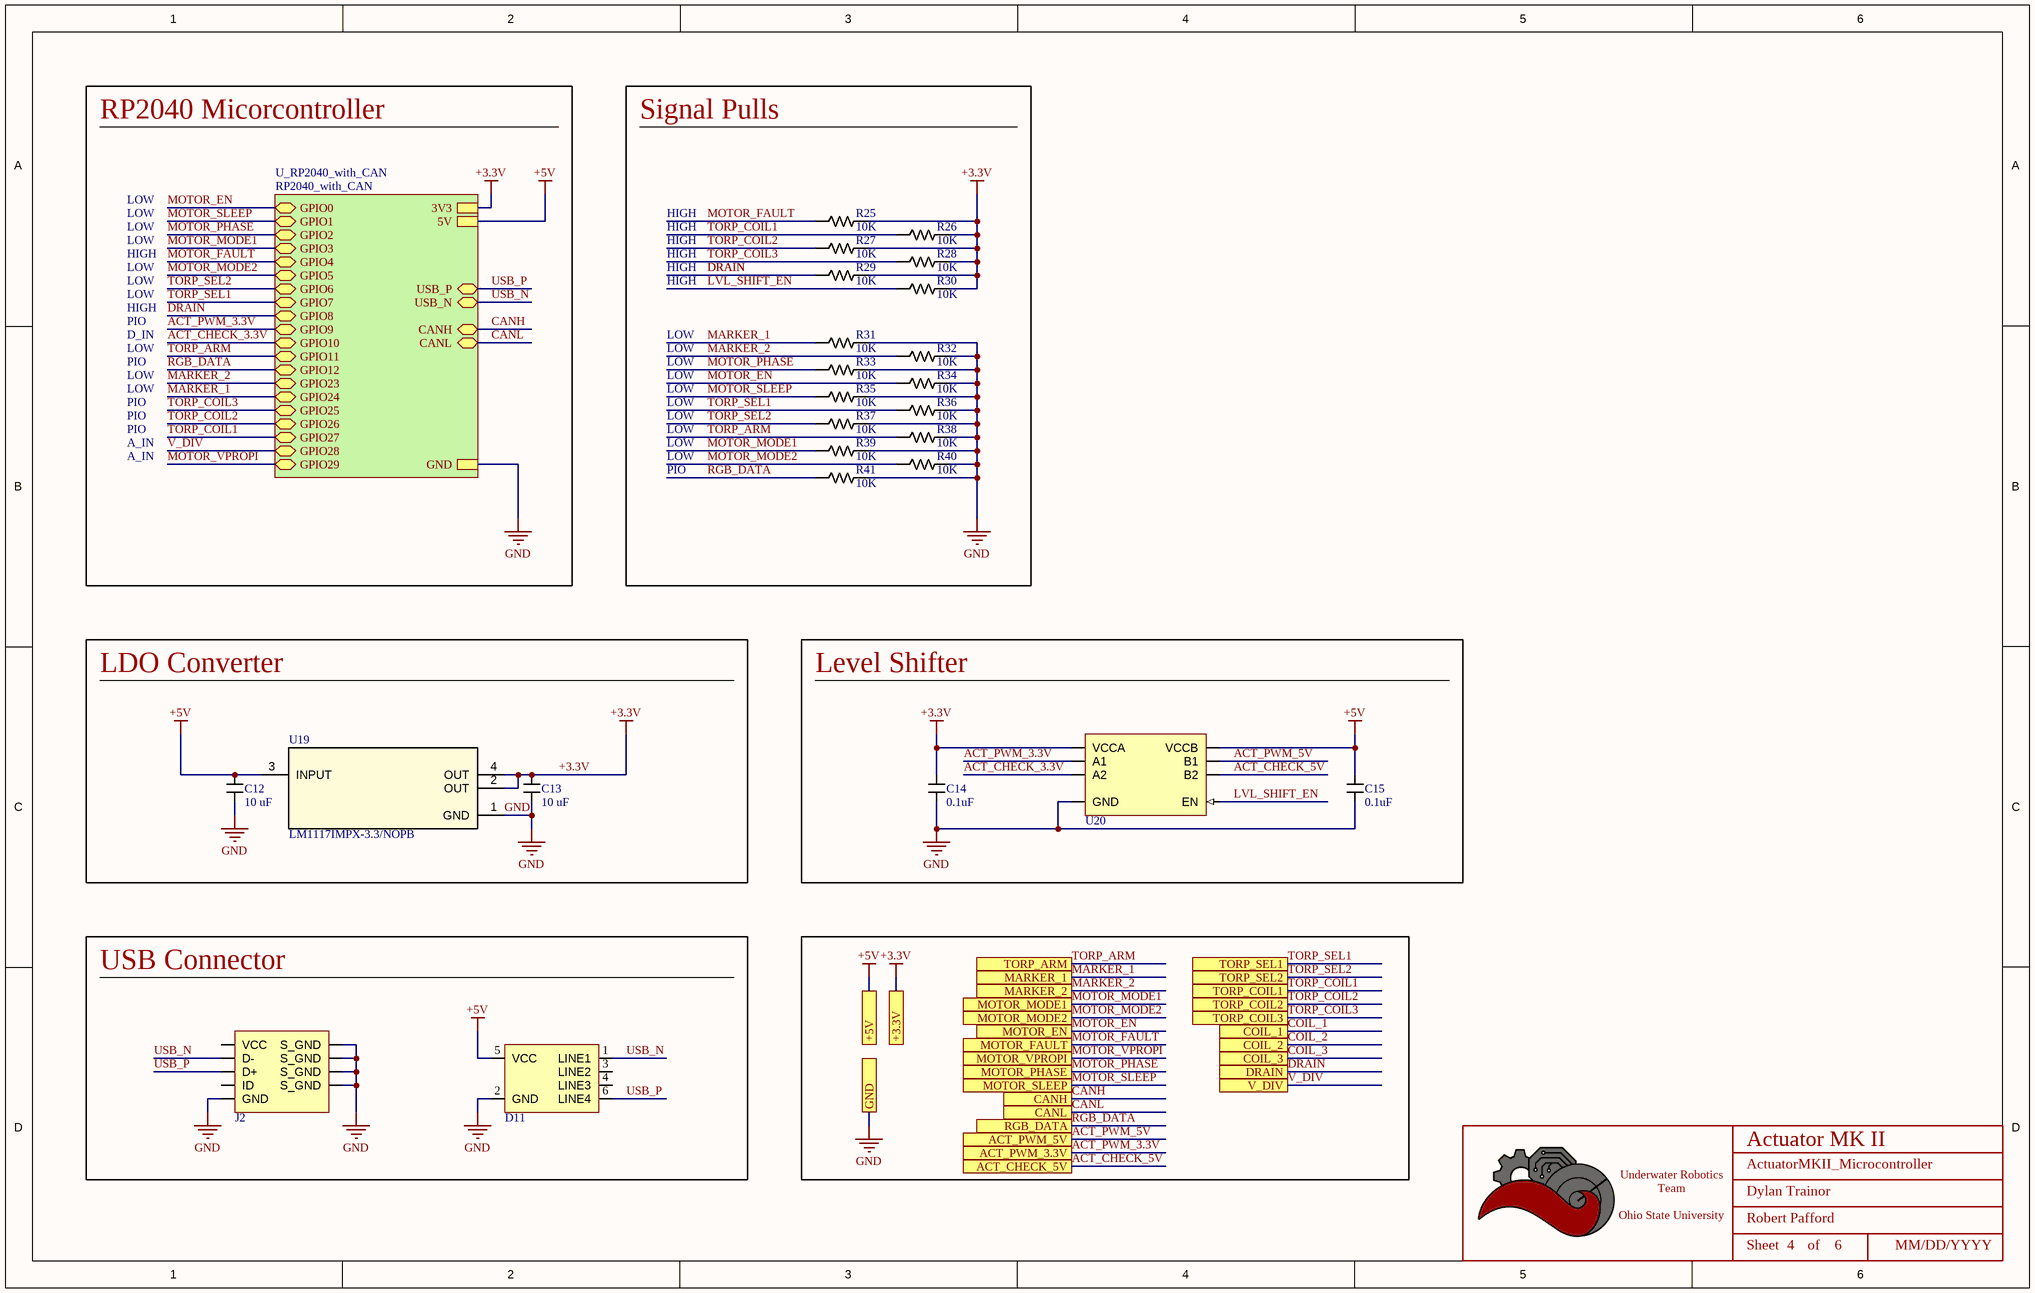
[diagram p3: ActuatorMKII_Microcontroller.SchDoc]

### Parts
(Parts that share a designator on the sheet are numbered #1, #2 ... from top to bottom, then left to right.)
*#4  Title_Block  [LOGO]  (value not drawn)  (graphical)
C12  Value (uF): 10 uF  [CAPACITOR_0603]  (hidden comment: 10uF Ceramic 6.3V)
C13  Value (uF): 10 uF  [CAPACITOR_0603]  (hidden comment: 10uF Ceramic 6.3V)
C14  value 0.1uF  [CAPACITOR_0603]  (hidden comment: 100nF Ceramic 6.3V)
C15  value 0.1uF  [CAPACITOR_0603]  (hidden comment: 100nF Ceramic 6.3V)
D11  TVS DIODE 5VWM 25VC SOT23-6  [SOT 23-6L]  (value not drawn)
J2  USB_MICRO R/A  [CONN_MINIUSB]  (value not drawn)
R25  Value  (Ohms): 10K  [RESISTOR_0603]  (hidden comment: 10k Ohm 5% 1/10W)
R26  Value  (Ohms): 10K  [RESISTOR_0603]  (hidden comment: 10k Ohm 5% 1/10W)
R27  Value  (Ohms): 10K  [RESISTOR_0603]  (hidden comment: 10k Ohm 5% 1/10W)
R28  Value  (Ohms): 10K  [RESISTOR_0603]  (hidden comment: 10k Ohm 5% 1/10W)
R29  Value  (Ohms): 10K  [RESISTOR_0603]  (hidden comment: 10k Ohm 5% 1/10W)
R30  Value  (Ohms): 10K  [RESISTOR_0603]  (hidden comment: 10k Ohm 5% 1/10W)
R31  Value  (Ohms): 10K  [RESISTOR_0603]  (hidden comment: 10k Ohm 5% 1/10W)
R32  Value  (Ohms): 10K  [RESISTOR_0603]  (hidden comment: 10k Ohm 5% 1/10W)
R33  Value  (Ohms): 10K  [RESISTOR_0603]  (hidden comment: 10k Ohm 5% 1/10W)
R34  Value  (Ohms): 10K  [RESISTOR_0603]  (hidden comment: 10k Ohm 5% 1/10W)
R35  Value  (Ohms): 10K  [RESISTOR_0603]  (hidden comment: 10k Ohm 5% 1/10W)
R36  Value  (Ohms): 10K  [RESISTOR_0603]  (hidden comment: 10k Ohm 5% 1/10W)
R37  Value  (Ohms): 10K  [RESISTOR_0603]  (hidden comment: 10k Ohm 5% 1/10W)
R38  Value  (Ohms): 10K  [RESISTOR_0603]  (hidden comment: 10k Ohm 5% 1/10W)
R39  Value  (Ohms): 10K  [RESISTOR_0603]  (hidden comment: 10k Ohm 5% 1/10W)
R40  Value  (Ohms): 10K  [RESISTOR_0603]  (hidden comment: 10k Ohm 5% 1/10W)
R41  Value  (Ohms): 10K  [RESISTOR_0603]  (hidden comment: 10k Ohm 5% 1/10W)
U19  LM1117IMPX-3.3/NOPB  [SOT-223-4]
U20  IC TRANSLTR BIDIRECTIONAL 8MSOP  [MSOP-8_PI4ULS5V202UEX]  (value not drawn)

### Blocks framed on the sheet
Signal Pulls: R25-R41
LDO Converter: C12 C13 U19
Level Shifter: C14 C15 U20
USB Connector: D11 J2

### Sub-sheets
U_RP2040_with_CAN = RP2040_with_CAN (file not in this document): USB_P (bidir), USB_N (bidir), 5V, CANH (bidir), CANL (bidir), GPIO0 (bidir), GPIO1 (bidir), GPIO2 (bidir), GPIO3 (bidir), GPIO4 (bidir), GPIO5 (bidir), GPIO6 (bidir), GPIO7 (bidir), GPIO8 (bidir), GPIO9 (bidir), GPIO10 (bidir), GPIO11 (bidir), GPIO12 (bidir), GPIO23 (bidir), GPIO24 (bidir), GPIO25 (bidir), GPIO26 (bidir), GPIO27 (bidir), GPIO28 (bidir), GPIO29 (bidir), 3V3, GND

### Ports
+3.3V, +5V, ACT_CHECK_5V, ACT_PWM_3.3V, ACT_PWM_5V, CANH, CANL, COIL_1, COIL_2, COIL_3, DRAIN, GND, MARKER_1, MARKER_2, MOTOR_EN, MOTOR_FAULT, MOTOR_MODE1, MOTOR_MODE2, MOTOR_PHASE, MOTOR_SLEEP, MOTOR_VPROPI, RGB_DATA, TORP_ARM, TORP_COIL1, TORP_COIL2, TORP_COIL3, TORP_SEL1, TORP_SEL2, V_DIV

### Nets
+3.3V: C13.1 C14.1 R25.1 R26.1 R27.1 R28.1 R29.1 R30.1 U19.2(OUT) U19.4(OUT) U20.1(VCCA) ; port +3.3V, sheet U_RP2040_with_CAN/3V3
+5V: C12.1 C15.1 D11.5(VCC) U19.3(INPUT) U20.8(VCCB) ; port +5V, sheet U_RP2040_with_CAN/5V
GND: C12.2 C13.2 C14.2 C15.2 D11.2(GND) J2.5(GND) J2.6(S_GND) J2.7(S_GND) J2.8(S_GND) J2.9(S_GND) R31.1 R32.1 R33.1 R34.1 R35.1 R36.1 R37.1 R38.1 R39.1 R40.1 R41.1 U19.1(GND) U20.4(GND) ; port GND, sheet U_RP2040_with_CAN/GND
ACT_CHECK_3.3V: U20.3(A2) ; sheet U_RP2040_with_CAN/GPIO10
ACT_CHECK_5V: U20.6(B2) ; port ACT_CHECK_5V
ACT_PWM_3.3V: U20.2(A1) ; port ACT_PWM_3.3V, sheet U_RP2040_with_CAN/GPIO9
ACT_PWM_5V: U20.7(B1) ; port ACT_PWM_5V
CANH: port CANH, sheet U_RP2040_with_CAN/CANH
CANL: port CANL, sheet U_RP2040_with_CAN/CANL
DRAIN: R29.2 ; port DRAIN, sheet U_RP2040_with_CAN/GPIO8
LVL_SHIFT_EN: R30.2 U20.5(EN)
MARKER_1: R31.2 ; port MARKER_1, sheet U_RP2040_with_CAN/GPIO24
MARKER_2: R32.2 ; port MARKER_2, sheet U_RP2040_with_CAN/GPIO23
MOTOR_EN: R34.2 ; port MOTOR_EN, sheet U_RP2040_with_CAN/GPIO0
MOTOR_FAULT: R25.2 ; port MOTOR_FAULT, sheet U_RP2040_with_CAN/GPIO4
MOTOR_MODE1: R39.2 ; port MOTOR_MODE1, sheet U_RP2040_with_CAN/GPIO3
MOTOR_MODE2: R40.2 ; port MOTOR_MODE2, sheet U_RP2040_with_CAN/GPIO5
MOTOR_PHASE: R33.2 ; port MOTOR_PHASE, sheet U_RP2040_with_CAN/GPIO2
MOTOR_SLEEP: R35.2 ; port MOTOR_SLEEP, sheet U_RP2040_with_CAN/GPIO1
MOTOR_VPROPI: port MOTOR_VPROPI, sheet U_RP2040_with_CAN/GPIO29
RGB_DATA: R41.2 ; port RGB_DATA, sheet U_RP2040_with_CAN/GPIO12
TORP_ARM: R38.2 ; port TORP_ARM, sheet U_RP2040_with_CAN/GPIO11
TORP_COIL1: R26.2 ; port TORP_COIL1, sheet U_RP2040_with_CAN/GPIO27
TORP_COIL2: R27.2 ; port TORP_COIL2, sheet U_RP2040_with_CAN/GPIO26
TORP_COIL3: R28.2 ; port TORP_COIL3, sheet U_RP2040_with_CAN/GPIO25
TORP_SEL1: R36.2 ; port TORP_SEL1, sheet U_RP2040_with_CAN/GPIO7
TORP_SEL2: R37.2 ; port TORP_SEL2, sheet U_RP2040_with_CAN/GPIO6
USB_N: D11.1(LINE1) J2.2(D-) ; sheet U_RP2040_with_CAN/USB_N
USB_P: D11.6(LINE4) J2.3(D+) ; sheet U_RP2040_with_CAN/USB_P
V_DIV: port V_DIV, sheet U_RP2040_with_CAN/GPIO28

Not connected (* = marked no-connect by the designer): D11 3(LINE2) 4(LINE3); J2 1(VCC) 4(ID)

### Notes on the sheet
- RP2040 Micorcontroller
- LOW
- HIGH
- D_IN
- PIO
- A_IN
- DWG. NO.
- REV.
- SHT.
- THIS DOCUMENT AND THE DATA DISCLOSED HEREIN OR HEREWITH IS THE PROPERTY OF ALTIUM LIMITED AND MAY BE FREELY DISTRIBUTED IN WHOLE. NO RIGHTS ARE RESERVED OR EXPRESS OR IMPLIED WARANTEE GIVEN.
- REVISION
- DESCRIPTION
- DATE
- APPROVED
- ENG:
- APPROVALS
- PROJECT
- DSN:
- CHK:
- REFERENCE DOCUMENTS
- PROJECT REVISION:
- TITLE
- DOCUMENT REVISION:
- DESIGN ITEM:
- BOM:
- FAB DWG:
- PCB DWG:
- ASSY DWG:
- SCALE:
- SIZE
- B
- CAGE CODE
- FILE NAME
- DWG NO.
- SHEET
- OF
- REV
- (in symbol Title_Block) Underwater Robotics Team / Ohio State University; Sheet; of

### Library data of the parts
*#4 = Title_Block: as *#1 on sheet ActuatorMKII_Connectors
C12 C13 = CAPACITOR_10uF_0603: as C1 on sheet ActuatorMKII_Connectors; ComponentLink1Description: Digikey; ComponentLink1URL: https://www.digikey.com/en/products/detail/samsung-electro-mechanics/CL10A106MQ8NNNC/3886777; Supplier 1: Digi-Key; Supplier Part Number 1: 1276-1119-1-ND; Tolerance: +/- 20%; Voltage: 6.3V
C14 C15 = CAPACITOR_0.1uF_0603: Cap 100nF 6.3V +/-10% / Ceramic 0603; Made By: Flip B; ComponentLink1Description: Datsheet; ComponentLink1URL: https://www.mouser.com/datasheet/2/212/KEM_C1002_X7R_SMD-1102033.pdf; Tolerance: +/- 10%; Voltage: 6.3V; Supplier 1: Digi-Key; Supplier Part Number 1: 399-15351-1-ND
D11 = RCLAMP0504S.TCT: 25V Clamp 6A (8/20µs) Ipp Tvs Diode Surface Mount SOT-23-6; Made By: Robert Pafford; Reverse Standoff Voltage (Typ): 5V; Breakdown Voltage (Min): 6V; Supplier 1: Digi-Key; Supplier Part Number 1: RCLAMP0504SCT-ND; Clamping Voltage (Max): 25V
J2 = CONN_MICROUSB: Amphenol Micro USB-B / USB2.0 5 Pin Right Angle SMD; Pitch: 0.65mm; Current Per Pin: 1.8A; Number of Positions: 5; Manufacturer: Amphenol; Configuration: Right Angle; Color: Silver; Created By: Flip B; ComponentLink1Description: Datasheet; ComponentLink1URL: https://cdn.amphenol-icc.com/media/wysiwyg/files/documentation/datasheet/inputoutput/io_usb_micro.pdf?__cf_chl_jschl_tk__=05693735e19256298f6ef6ca2bb2e65c376a4f56-1625503833-0-Abitsb0-ufjOXJYs_S3J3r2iTn-nObalbmXUksF1VvO_h_WEmRdMlUD1I8-hmWSEVWzY1pirKnrPZWfgY3851qyBZe5ZvnNQePLGIzUgdEIQBVUyW36RsbYpDLEWxJ4horD-5gChFgobLYqwmG5aHl0E8lIn_twwPPrOxilK2gP0q9t_CNOs_u5fMqXvXUrlsOv8tIE2NRlu6NVP8qtkL2GjhlkeTUbDMF8WvvpPDTFOgvZ4Y16Ej8F8AhWos88mo5B1HssXozw0XrkJQIqERITUu6rqloz9kf4ZzhBHtDAt-IkiAFY_Ds9SW8FYKKTtINJVpHZQ6Gyu1FFM4Dc9MO0maE8_mmNcwlxqyRoRk_MPWW8VyByXWM5RSp52jteRKw7FeI9WIYvCbPAOy0Eyib-aseIQsnGbglBcUY6_2xp8GYaJM38H3dNvBPsSOfJBPndKedwKHllxjkucXn6xsN0sDXkpGN-cu8_2bDTJ0g-uUucKSCooYX-ApSDNGpkA_p9zv1SOAD8c0zaZVmtiBsN75QpVz2rzq9_BFxOywPvR; Series: 10118192; Supplier 1: Digi-Key; Supplier Part Number 1: 609-4613-1-ND
R25-R41 = RESISTOR_10K_0603: as R11 on sheet ActuatorMKII_Torpedoes; ComponentLink1Description: Datasheet; ComponentLink1URL: https://www.bourns.com/docs/product-datasheets/CRxxxxx.pdf; Supplier: Digikey; Digikey Part Numer: CR0603-JW-104ELFTR-ND; Supplier 1: Digi-Key; Supplier Part Number 1: 2019-RK73B1JTTD103JCT-ND
U19 = LM1117IMPX-3.3/NOPB: IC REG LIN 3.3V 800MA SOT223-4; PartNumber: LM1117IMP-3.3/NOPB; Manufacturer: Texas Instruments; Vin (Max): 15V; Supplier 1: Digi-Key; Supplier Part Number 1: LM1117IMPX-3.3/NOPBCT-ND; Vout (Min/Fixed): 3.3V; Amp Out: 800mA; Package: SOT-223-4; Created By: Dylan T
U20 = PI4ULS5V202UEX: Voltage Level Translator Bidirectional 1 Circuit 2 Channel 20Mbps 8-MSOP; Made By: Robert Pafford; Channels: 2; Voltage Range: 1.2 V ~ 5.5 V; Channel Type: Bidirectional; Max Rate: 20 Mbps; Supplier 1: Digi-Key; Supplier Part Number 1: PI4ULS5V202UEXDICT-ND

## Nets that join several sheets
+3.3V: ActuatorMKII_Connectors (DEBUG_CONN.2), ActuatorMKII_Microcontroller (11 pins)
+5V: ActuatorMKII_Connectors (C1.1 DEBUG_CONN.1 LED_CONN.1 POWER_CONN.5), ActuatorMKII_Microcontroller (5 pins)
+12V: ActuatorMKII_Connectors (LID_CONN.4 LID_CONN.5), ActuatorMKII_Circuits (8 pins)
+15V: ActuatorMKII_Connectors (POWER_CONN.6), ActuatorMKII_Circuits (C8.1 U3.1), ActuatorMKII_Torpedoes (R13.1 R14.1 R15.1 R19.1)
+24V: ActuatorMKII_Circuits (1.2 D1.2), ActuatorMKII_Torpedoes (13 pins)
GND: ActuatorMKII_Connectors (5 pins), ActuatorMKII_Circuits (23 pins), ActuatorMKII_Torpedoes (17 pins), ActuatorMKII_Microcontroller (23 pins)
V+: ActuatorMKII_Connectors (POWER_CONN.3), ActuatorMKII_Circuits (D4.1 Q1.2 R2.1 U2.2), ActuatorMKII_Torpedoes (R23.1 U17.1)
ACT+: ActuatorMKII_Connectors (LID_CONN.14), ActuatorMKII_Circuits (J1.2)
ACT-: ActuatorMKII_Connectors (LID_CONN.13), ActuatorMKII_Circuits (J1.5)
ACT_CHECK_5V: ActuatorMKII_Connectors (LID_CONN.7), ActuatorMKII_Microcontroller (U20.6)
ACT_PWM_3.3V: ActuatorMKII_Connectors (DEBUG_CONN.11), ActuatorMKII_Microcontroller (U20.2)
ACT_PWM_5V: ActuatorMKII_Connectors (LID_CONN.6), ActuatorMKII_Microcontroller (U20.7)
COIL_1: ActuatorMKII_Connectors (LID_CONN.8), ActuatorMKII_Torpedoes (D5.1 U8.3)
COIL_2: ActuatorMKII_Connectors (LID_CONN.9), ActuatorMKII_Torpedoes (D6.1 U10.3)
COIL_3: ActuatorMKII_Connectors (LID_CONN.10), ActuatorMKII_Torpedoes (D7.1 U9.3)
DRAIN: ActuatorMKII_Connectors (DEBUG_CONN.12), ActuatorMKII_Torpedoes (U18.1), ActuatorMKII_Microcontroller (R29.2)
DROPPER_1: ActuatorMKII_Connectors (LID_CONN.11), ActuatorMKII_Circuits (U4.3)
DROPPER_2: ActuatorMKII_Connectors (LID_CONN.12), ActuatorMKII_Circuits (U5.3)
MARKER_1: ActuatorMKII_Connectors (DEBUG_CONN.8), ActuatorMKII_Circuits (U4.1), ActuatorMKII_Microcontroller (R31.2)
MARKER_2: ActuatorMKII_Connectors (DEBUG_CONN.9), ActuatorMKII_Circuits (U5.1), ActuatorMKII_Microcontroller (R32.2)
MOTOR_EN: ActuatorMKII_Connectors (DEBUG_CONN.18), ActuatorMKII_Circuits (D3.1 U1.6), ActuatorMKII_Microcontroller (R34.2)
MOTOR_FAULT: ActuatorMKII_Connectors (DEBUG_CONN.15), ActuatorMKII_Circuits (U1.1), ActuatorMKII_Microcontroller (R25.2)
MOTOR_MODE1: ActuatorMKII_Circuits (U1.2), ActuatorMKII_Microcontroller (R39.2)
MOTOR_MODE2: ActuatorMKII_Circuits (U1.16), ActuatorMKII_Microcontroller (R40.2)
MOTOR_PHASE: ActuatorMKII_Connectors (DEBUG_CONN.16), ActuatorMKII_Circuits (U1.3), ActuatorMKII_Microcontroller (R33.2)
MOTOR_SLEEP: ActuatorMKII_Connectors (DEBUG_CONN.17), ActuatorMKII_Circuits (U1.5), ActuatorMKII_Microcontroller (R35.2)
MOTOR_VPROPI: ActuatorMKII_Connectors (DEBUG_CONN.3), ActuatorMKII_Circuits (C3.1 R1.1)
RGB_DATA: ActuatorMKII_Connectors (LED_CONN.2), ActuatorMKII_Microcontroller (R41.2)
TORP_ARM: ActuatorMKII_Connectors (DEBUG_CONN.10), ActuatorMKII_Circuits (D2.1 R5.1), ActuatorMKII_Microcontroller (R38.2)
TORP_COIL1: ActuatorMKII_Connectors (DEBUG_CONN.5), ActuatorMKII_Torpedoes (U11.1), ActuatorMKII_Microcontroller (R26.2)
TORP_COIL2: ActuatorMKII_Connectors (DEBUG_CONN.6), ActuatorMKII_Torpedoes (U12.1), ActuatorMKII_Microcontroller (R27.2)
TORP_COIL3: ActuatorMKII_Connectors (DEBUG_CONN.7), ActuatorMKII_Torpedoes (U13.1), ActuatorMKII_Microcontroller (R28.2)
TORP_SEL1: ActuatorMKII_Connectors (DEBUG_CONN.13), ActuatorMKII_Torpedoes (U15.1), ActuatorMKII_Microcontroller (R36.2)
TORP_SEL2: ActuatorMKII_Connectors (DEBUG_CONN.14), ActuatorMKII_Torpedoes (U14.1), ActuatorMKII_Microcontroller (R37.2)
TORPEDO_1: ActuatorMKII_Connectors (LID_CONN.1), ActuatorMKII_Torpedoes (U6.3)
TORPEDO_2: ActuatorMKII_Connectors (LID_CONN.3), ActuatorMKII_Torpedoes (U7.3)
V_DIV: ActuatorMKII_Connectors (DEBUG_CONN.4), ActuatorMKII_Torpedoes (D9.2 R20.2 R22.1)